# Altium schematic sheet [11] - SD CARD, BUFFERS.SchDoc
size A3; DocumentNumber: 11; SheetNumber: 11; SheetTotal: 18
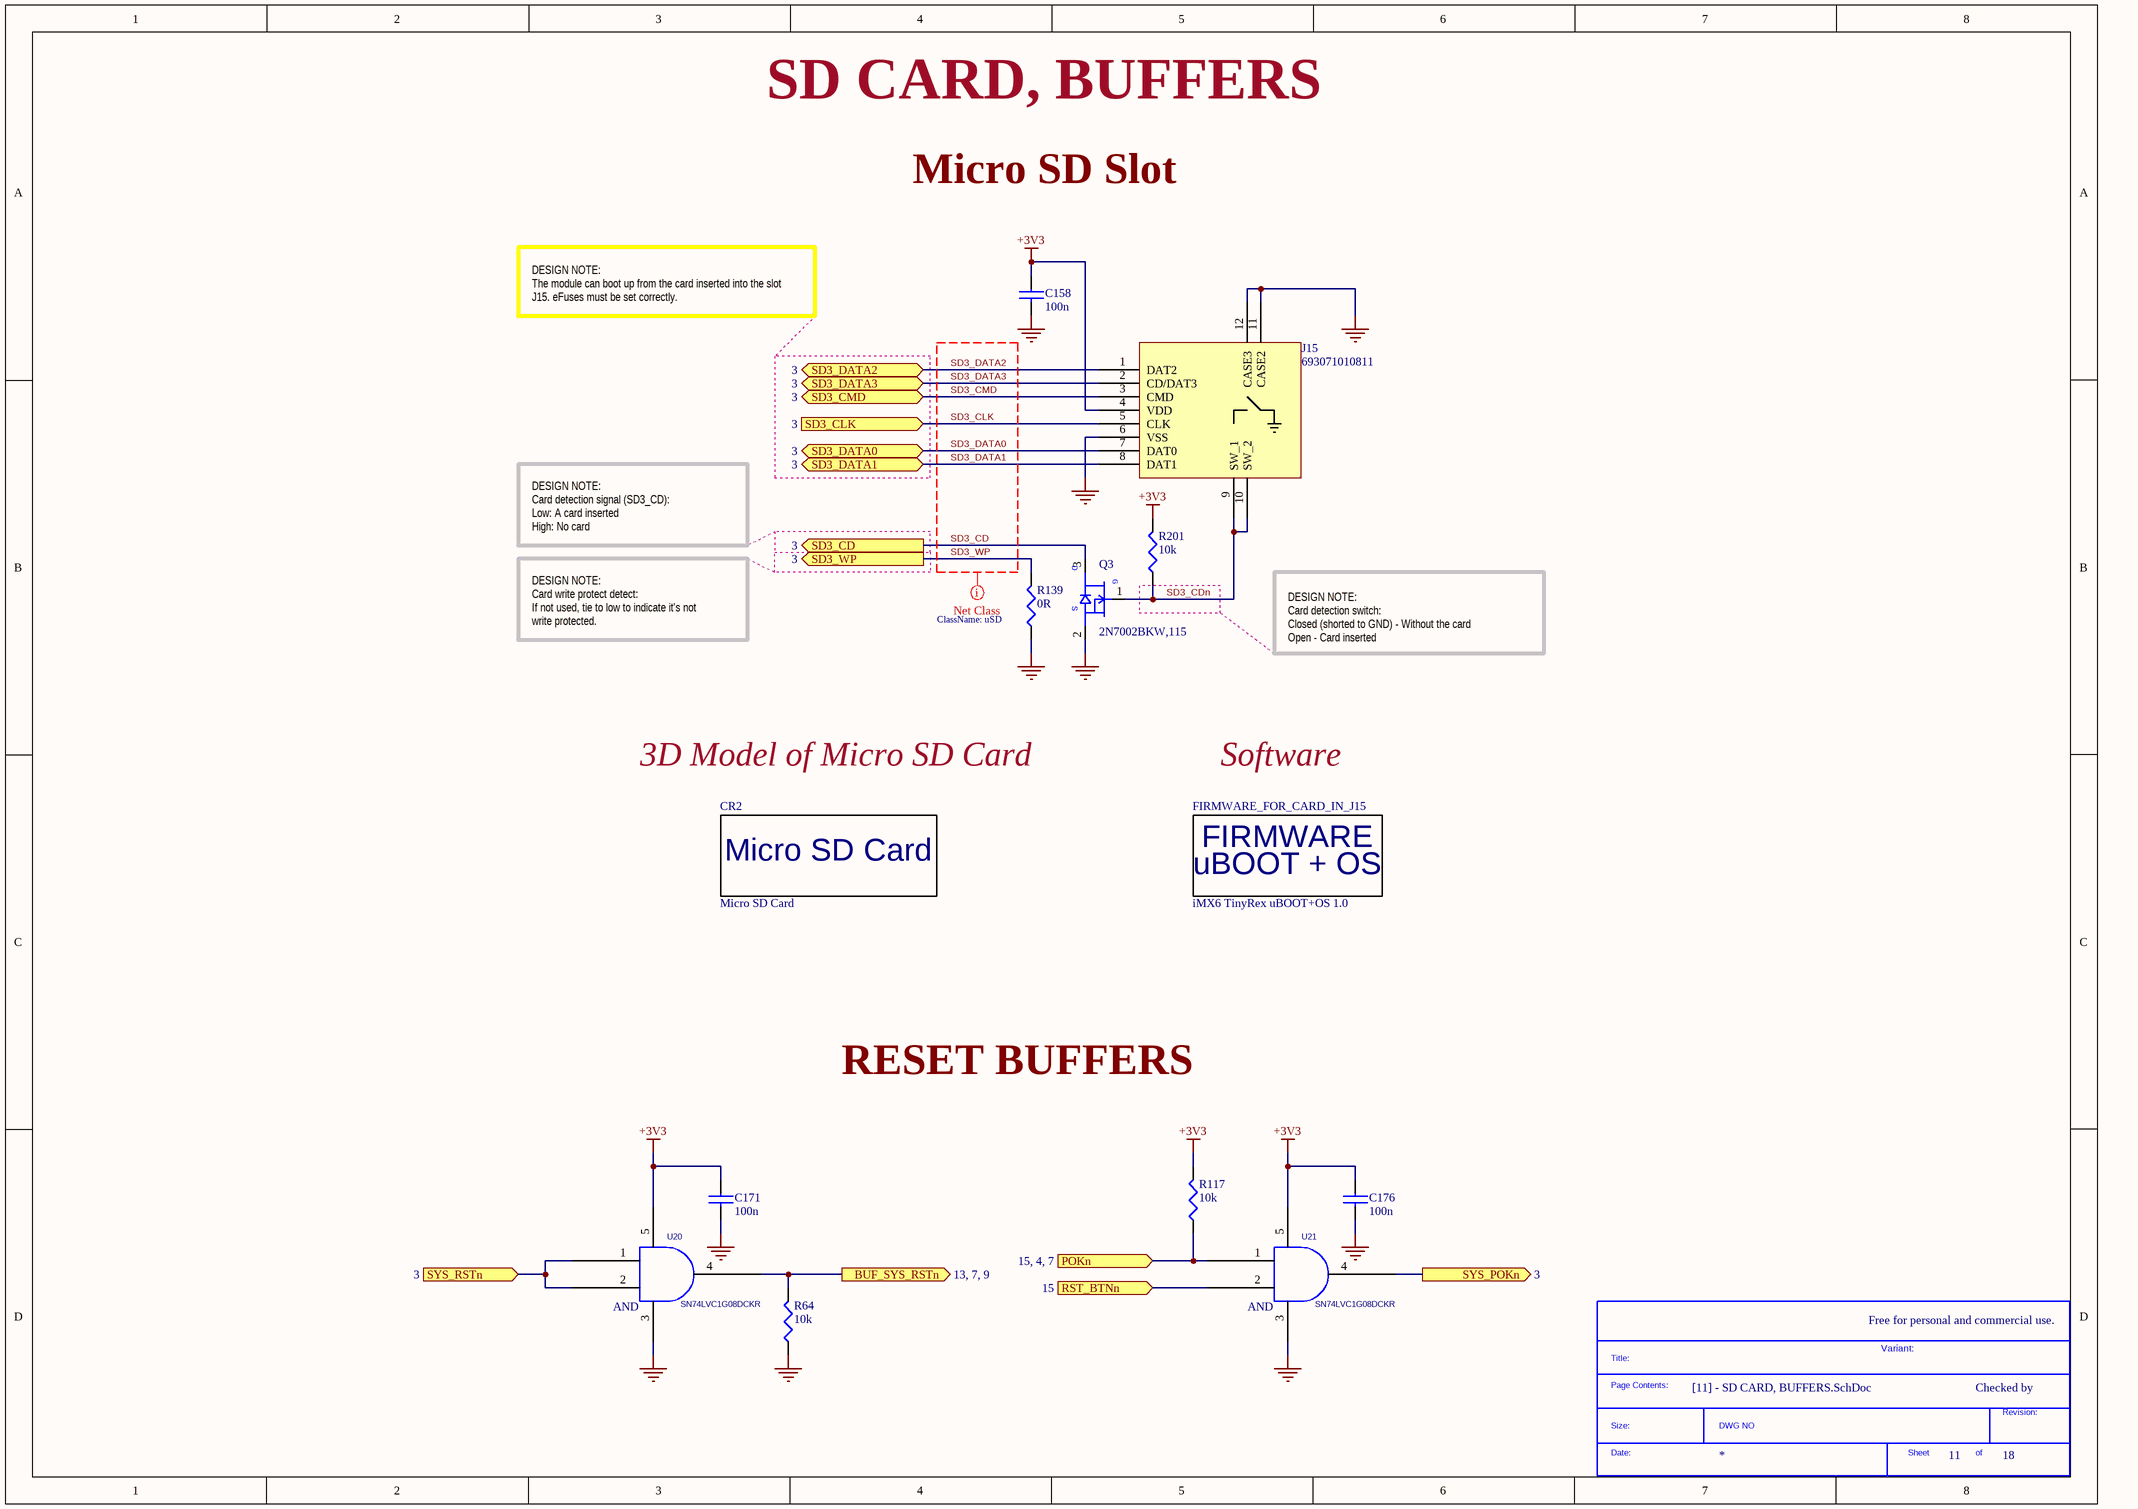
[diagram p0: [11] - SD CARD, BUFFERS.SchDoc]

## Parts
*  SDTitleBlock  (value not drawn)  (graphical)
C158  100n  [C0402]
C171  100n  [C0402]
C176  100n  [C0402]
CR2  Micro SD Card  [Micro_SD_card]  (no BOM)
FIRMWARE_FOR_CARD_IN_J15  iMX6 TinyRex uBOOT+OS 1.0  (mechanical)
J15  693071010811  [693071010811]
Q3  2N7002BKW,115  [SC70_SOT323]
R64  10k  [R0402]
R117  10k  [R0402]
R139  0R  [R0402]
R201  10k  [R0402]
U20  SN74LVC1G08DCKR  [SC70_5]
U21  SN74LVC1G08DCKR  [SC70_5]

## Ports
BUF_SYS_RSTn (see 13, 7, 9), POKn (see 15, 4, 7), RST_BTNn (in, see 15), SD3_CD (out, see 3), SD3_CLK (in, see 3), SD3_CMD (bidir, see 3), SD3_DATA0 (bidir, see 3), SD3_DATA1 (bidir, see 3), SD3_DATA2 (bidir, see 3), SD3_DATA3 (bidir, see 3), SD3_WP (out, see 3), SYS_POKn (out, see 3), SYS_RSTn (in, see 3)

## Nets
+3V3: C158.1 C171.1 C176.1 J15.4(VDD) R117.2 R201.2 U20.5(VCC) U21.5(VCC)
GND: C158.2 C171.2 C176.2 J15.6(VSS) J15.11(CASE2) J15.12(CASE3) Q3.2(SOURCE) R64.1 R139.1 U20.3(GND) U21.3(GND)
BUF_SYS_RSTn: R64.2 U20.4(Y) ; port BUF_SYS_RSTn
POKn: R117.1 U21.1(A) ; port POKn
RST_BTNn: U21.2(B) ; port RST_BTNn
SD3_CD: Q3.3(DRAIN) ; port SD3_CD
SD3_CDn: J15.9(SW_1) J15.10(SW_2) Q3.1(GATE) R201.1
SD3_CLK: J15.5(CLK) ; port SD3_CLK
SD3_CMD: J15.3(CMD) ; port SD3_CMD
SD3_DATA0: J15.7(DAT0) ; port SD3_DATA0
SD3_DATA1: J15.8(DAT1) ; port SD3_DATA1
SD3_DATA2: J15.1(DAT2) ; port SD3_DATA2
SD3_DATA3: J15.2(CD/DAT3) ; port SD3_DATA3
SD3_WP: R139.2 ; port SD3_WP
SYS_POKn: U21.4(Y) ; port SYS_POKn
SYS_RSTn: U20.1(A) U20.2(B) ; port SYS_RSTn

## Layout directives
net class uSD: SD3_CD, SD3_CLK, SD3_CMD, SD3_DATA0, SD3_DATA1, SD3_DATA2, SD3_DATA3, SD3_WP

## Notes on the sheet
- SD CARD, BUFFERS
- Micro SD Slot
- DESIGN NOTE:
  The module can boot up from the card inserted into the slot J15. eFuses must be set correctly.
- DESIGN NOTE:
  Card detection signal (SD3_CD):
  Low: A card inserted
  High: No card
- DESIGN NOTE:
  Card write protect detect:
  If not used, tie to low to indicate it's not write protected.
- DESIGN NOTE:
  Card detection switch:
  Closed (shorted to GND) - Without the card
  Open - Card inserted
- 3D Model of Micro SD Card
- Software
- RESET BUFFERS
- Free for personal and commercial use.
- Variant:
- Checked by
- (in symbol 2N7002BKW,115) D; G; S
- (in symbol FIRMWARE_iMX6_TinyRex_uBOOT_OS 1.0) FIRMWARE; uBOOT + OS
- (in symbol SDTitleBlock) Title:; Page Contents:; Revision:; Size:; DWG NO; Date:; Sheet; of
- (in symbol SN74LVC1G08DCKR) AND

## Library data of the parts
C158 C171 C176 = C1005X5R1H104K: CAP CER .10UF 50V X5R 10% 0402; Manufacturer: TDK Corporation; Capacitance: 0.1µF; Value: 100nF; .Checked PCB: used; Category: Capacitors; Supplier Part Number: 445-5942-1-ND; Manufacturer Part Number: C1005X5R1H104K; Operating Temperature: -55°C ~ 85°C; Package / Case: 0402 (1005 Metric); Price 1k [$]: 0.02340; .Checked SCH: used; Voltage - Rated: 50V; Supplier: Digikey; Supplier 1: Digi-Key; Supplier Part Number 1: 445-5942-1-ND; RoHS: RoHS Compliant; Stock 1: 106926; Pricing 1: 1=0.27, 10=0.18, 100=0.072, 250=0.05176, 500=0.0369, 1000=0.027 (USD); Tolerance: ±10%; Temperature Coefficient: X5R; Mounting Type: Surface Mount, MLCC; Applications: General Purpose; Ratings: -; Size / Dimension: 0.039" L x 0.020" W (1.00mm x 0.50mm); Height - Seated (Max): -; Thickness (Max): 0.022" (0.55mm); Lead Spacing: -; Features: -; Packaging: Cut Tape (CT); Lead Style: -; ComponentLink1URL: http://www.tdk.co.jp/tefe02/e412_c.pdf; ComponentLink1Description: http://www.tdk.co.jp/tefe02/e412_c.pdf
CR2 = Card_Micro_SD: Card Micro SD; .Creator: MM; Category: Card
FIRMWARE_FOR_CARD_IN_J15 = FIRMWARE_iMX6_TinyRex_uBOOT_OS 1.0: .Creator: MM; Category: Firmware; .Checked SCH: MM
J15 = 693071010811: CONN MICRO SD 8 POS SMD; Manufacturer: Wurth Electronics Inc; Card Type: Secure Digital - microSD™; Number of Positions: 9 (8 + 1); Connector Type: Connector and Ejector; Insertion, Removal Method: Push In, Push Out; .Creator: MM; .Checked PCB: used; Supplier 1: Digi-Key; Manufacturer Part Number: 693071010811; RoHS: RoHS Compliant; Category: Connectors, Interconnects; Stock 1: 4877; Pricing 1: 1=3.32, 10=3.188, 50=2.805, 100=2.6775, 500=2.295, 1400=2.10375 (USD); Packaging: Cut Tape (CT); Ejector Side: -; Mounting Type: Surface Mount, Right Angle; Features: Switch; Height Above Board: 0.072" (1.83mm); Mounting Feature: Normal, Standard - Top; Contact Finish: Gold; Contact Finish Thickness: -; ComponentLink1URL: http://katalog.we-online.de/em/datasheet/693071010811.pdf; ComponentLink1Description: http://katalog.we-online.de/em/datasheet/693071010811.pdf; Supplier Part Number 1: 732-3819-1-ND; .Checked SCH: used
Q3 = 2N7002BKW,115: MOSFET N-CH 60V 310MA SOT323; Manufacturer: NXP Semiconductors; FET Type: MOSFET N-Channel, Metal Oxide; FET Feature: Logic Level Gate; Rds On (Max) @ Id, Vgs: 1.6 Ohm @ 500mA, 10V; Vgs(th) (Max) @ Id: 2.1V @ 250µA; Gate Charge (Qg) @ Vgs: 0.6nC @ 4.5V; Input Capacitance (Ciss) @ Vds: 50pF @ 10V; Power - Max: 275mW; .Checked PCB: used; Supplier 1: Digi-Key; Supplier Part Number 1: 568-5980-1-ND; Manufacturer Part Number: 2N7002BKW,115; RoHS: RoHS Compliant; Category: Discrete Semiconductor Products; Stock 1: 15666; Pricing 1: 1=0.39, 10=0.354, 25=0.2548, 100=0.1983, 250=0.12456, 500=0.10616, 1000=0.07233 (USD); Drain to Source Voltage (Vdss): 60V; Current - Continuous Drain (Id) @ 25° C: 310mA; Mounting Type: Surface Mount; Package / Case: SC-70, SOT-323; Supplier Device Package: SC-70; Packaging: Cut Tape (CT); ComponentLink1URL: http://www.nxp.com/documents/data_sheet/2N7002BKW.pdf; ComponentLink1Description: http://www.nxp.com/documents/data_sheet/2N7002BKW.pdf; .Checked SCH: used
R64 R117 R201 = RC0402FR-0710KL: RES 10.0K OHM 1/16W 1% 0402 SMD; Manufacturer: Yageo; Power (Watts): 0.063W, 1/16W; .Checked PCB: used; Temperature Coefficient: ±100ppm/°C; Category: Resistors; Supplier Part Number: 311-10.0KLRCT-ND; Manufacturer Part Number: RC0402FR-0710KL; Package / Case: 0402 (1005 Metric); Price 1k [$]: 0.01421; Resistance (Ohms): 10K; Tolerance: ±1%; Value: 10k; .Checked SCH: used; Supplier: Digikey; Supplier 1: Digi-Key; Supplier Part Number 1: 311-10.0KLRCT-ND; RoHS: RoHS Compliant; Stock 1: 2916495; Pricing 1: 10=0.014, 50=0.0104, 100=0.0079, 250=0.00584, 500=0.00432, 1000=0.00288 (USD); Composition: Thick Film; Features: -; Size / Dimension: 0.039" L x 0.020" W (1.00mm x 0.50mm); Height: 0.016" (0.40mm); Number of Terminations: 2; Packaging: Cut Tape (CT); ComponentLink1URL: http://www.yageo.com/documents/recent/PYu-RC0402_51_RoHS_L_6.pdf; ComponentLink1Description: http://www.yageo.com/documents/recent/PYu-RC0402_51_RoHS_L_6.pdf
R139 = RC0402JR-070RL: RES 0.0 OHM 1/16W 0402 SMD; Manufacturer: Yageo; Resistance (Ohms): 0.0; Power (Watts): 0.063W, 1/16W; Tolerance: Jumper; .Checked PCB: used; Category: Resistors; Supplier Part Number: 311-0.0JRCT-ND; Manufacturer Part Number: RC0402JR-070RL; Package / Case: 0402 (1005 Metric); Price 1k [$]: 0.01389; Value: 0R; .Checked SCH: used; Supplier: Digikey; Supplier 1: Digi-Key; Supplier Part Number 1: 311-0.0JRCT-ND; RoHS: RoHS Compliant; Stock 1: 1106330; Pricing 1: 10=0.012, 50=0.009, 100=0.0069, 250=0.00512, 500=0.0038, 1000=0.00253 (USD); Composition: Thick Film; Features: -; Temperature Coefficient: -; Size / Dimension: 0.039" L x 0.020" W (1.00mm x 0.50mm); Height: 0.016" (0.40mm); Number of Terminations: 2; Packaging: Cut Tape (CT); ComponentLink1URL: http://www.yageo.com/documents/recent/PYu-RC0402_51_RoHS_L_6.pdf; ComponentLink1Description: http://www.yageo.com/documents/recent/PYu-RC0402_51_RoHS_L_6.pdf
U20 U21 = SN74LVC1G08DCKR: SINGLE POSITIVE AND GATE SC-70; Manufacturer: Texas Instruments; .Checked PCB: used; Number of Inputs: 2; Voltage - Supply: 1.65 V ~ 5.5 V; Number of Circuits: 1; Current - Output High, Low: 32mA, 32mA; .Checked SCH: used; Category: Integrated Circuits (ICs); Supplier Part Number: 296-11602-1-ND; Family: Logic - Gates and Inverters; Manufacturer Part Number: SN74LVC1G08DCKR; Operating Temperature: -40°C ~ 85°C; Package / Case: 6-TSSOP (5 lead), SC-88A, SOT-353; Price 1k [$]: 0.11250; Value: SN74LVC1G08DCKR; Logic Type: AND Gate; Supplier: Digikey; Supplier 1: Digi-Key; Supplier Part Number 1: 296-11602-1-ND; RoHS: RoHS Compliant; Stock 1: 36212; Pricing 1: 1=0.7, 25=0.322, 100=0.224, 250=0.1596, 500=0.1218, 1000=0.084 (USD); Mounting Type: Surface Mount; Supplier Device Package: SC-70-5; Packaging: Cut Tape (CT); ComponentLink1URL: http://www.ti.com/lit/ds/symlink/sn74lvc1g08.pdf; ComponentLink1Description: http://www.ti.com/lit/ds/symlink/sn74lvc1g08.pdf